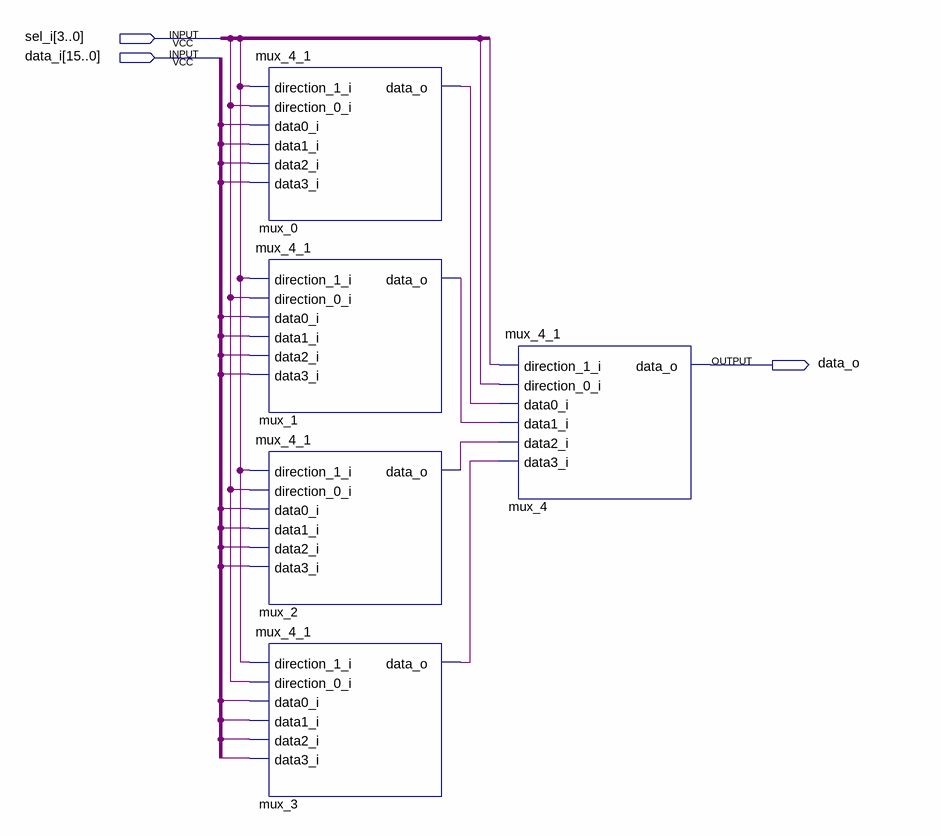
[diagram p0: schematic sheet]
// Quartus schematic mux_16_1.bdf as structural Verilog: 5 symbols, 3 pins
module mux_16_1 (
  input  [3:0] sel_i,
  input  [15:0] data_i,
  output data_o
);

  wire mux_0_data_o, mux_1_data_o, mux_2_data_o, mux_3_data_o;

  mux_4_1 mux_0 (
    .direction_1_i(sel_i[1]), .direction_0_i(sel_i[0]), .data0_i(data_i[0]), .data1_i(data_i[1]),
    .data2_i(data_i[2]), .data3_i(data_i[3]), .data_o(mux_0_data_o));
  mux_4_1 mux_1 (
    .direction_1_i(sel_i[1]), .direction_0_i(sel_i[0]), .data0_i(data_i[4]), .data1_i(data_i[5]),
    .data2_i(data_i[6]), .data3_i(data_i[7]), .data_o(mux_1_data_o));
  mux_4_1 mux_2 (
    .direction_1_i(sel_i[1]), .direction_0_i(sel_i[0]), .data0_i(data_i[8]), .data1_i(data_i[9]),
    .data2_i(data_i[10]), .data3_i(data_i[11]), .data_o(mux_2_data_o));
  mux_4_1 mux_3 (
    .direction_1_i(sel_i[1]), .direction_0_i(sel_i[0]), .data0_i(data_i[12]), .data1_i(data_i[13]),
    .data2_i(data_i[14]), .data3_i(data_i[15]), .data_o(mux_3_data_o));
  mux_4_1 mux_4 (
    .direction_1_i(sel_i[3]), .direction_0_i(sel_i[2]), .data0_i(mux_0_data_o), .data1_i(mux_1_data_o),
    .data2_i(mux_2_data_o), .data3_i(mux_3_data_o), .data_o(data_o));
endmodule
